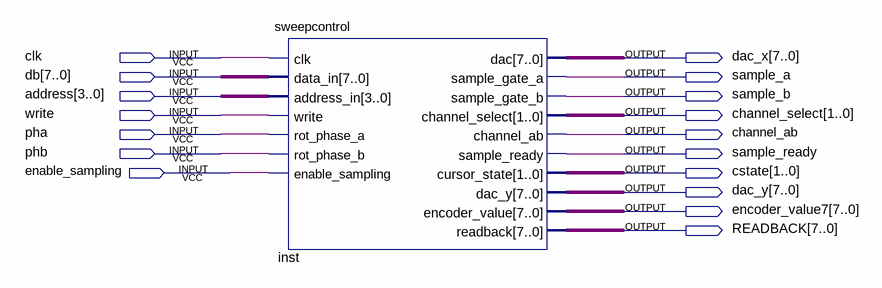
[diagram p0: schematic sheet]
// Quartus schematic toplevel.bdf as structural Verilog: 1 symbols, 17 pins
module toplevel (
  input  clk,
  input  [7:0] db,
  input  [3:0] address,
  input  write,
  input  pha,
  input  phb,
  input  enable_sampling,
  output [7:0] dac_x,
  output sample_a,
  output sample_b,
  output [1:0] channel_select,
  output channel_ab,
  output sample_ready,
  output [1:0] cstate,
  output [7:0] dac_y,
  output [7:0] encoder_value7,
  output [7:0] READBACK
);

  sweepcontrol inst (
    .clk(clk), .data_in(db), .address_in(address), .write(write), .rot_phase_a(pha), .rot_phase_b(phb),
    .enable_sampling(enable_sampling), .dac(dac_x), .sample_gate_a(sample_a), .sample_gate_b(sample_b),
    .channel_select(channel_select), .channel_ab(channel_ab), .sample_ready(sample_ready),
    .cursor_state(cstate), .dac_y(dac_y), .encoder_value(encoder_value7), .readback(READBACK));
endmodule
